# Altium schematic sheet Sheet.SchDoc
size A3; SheetNumber: 1; SheetTotal: 1
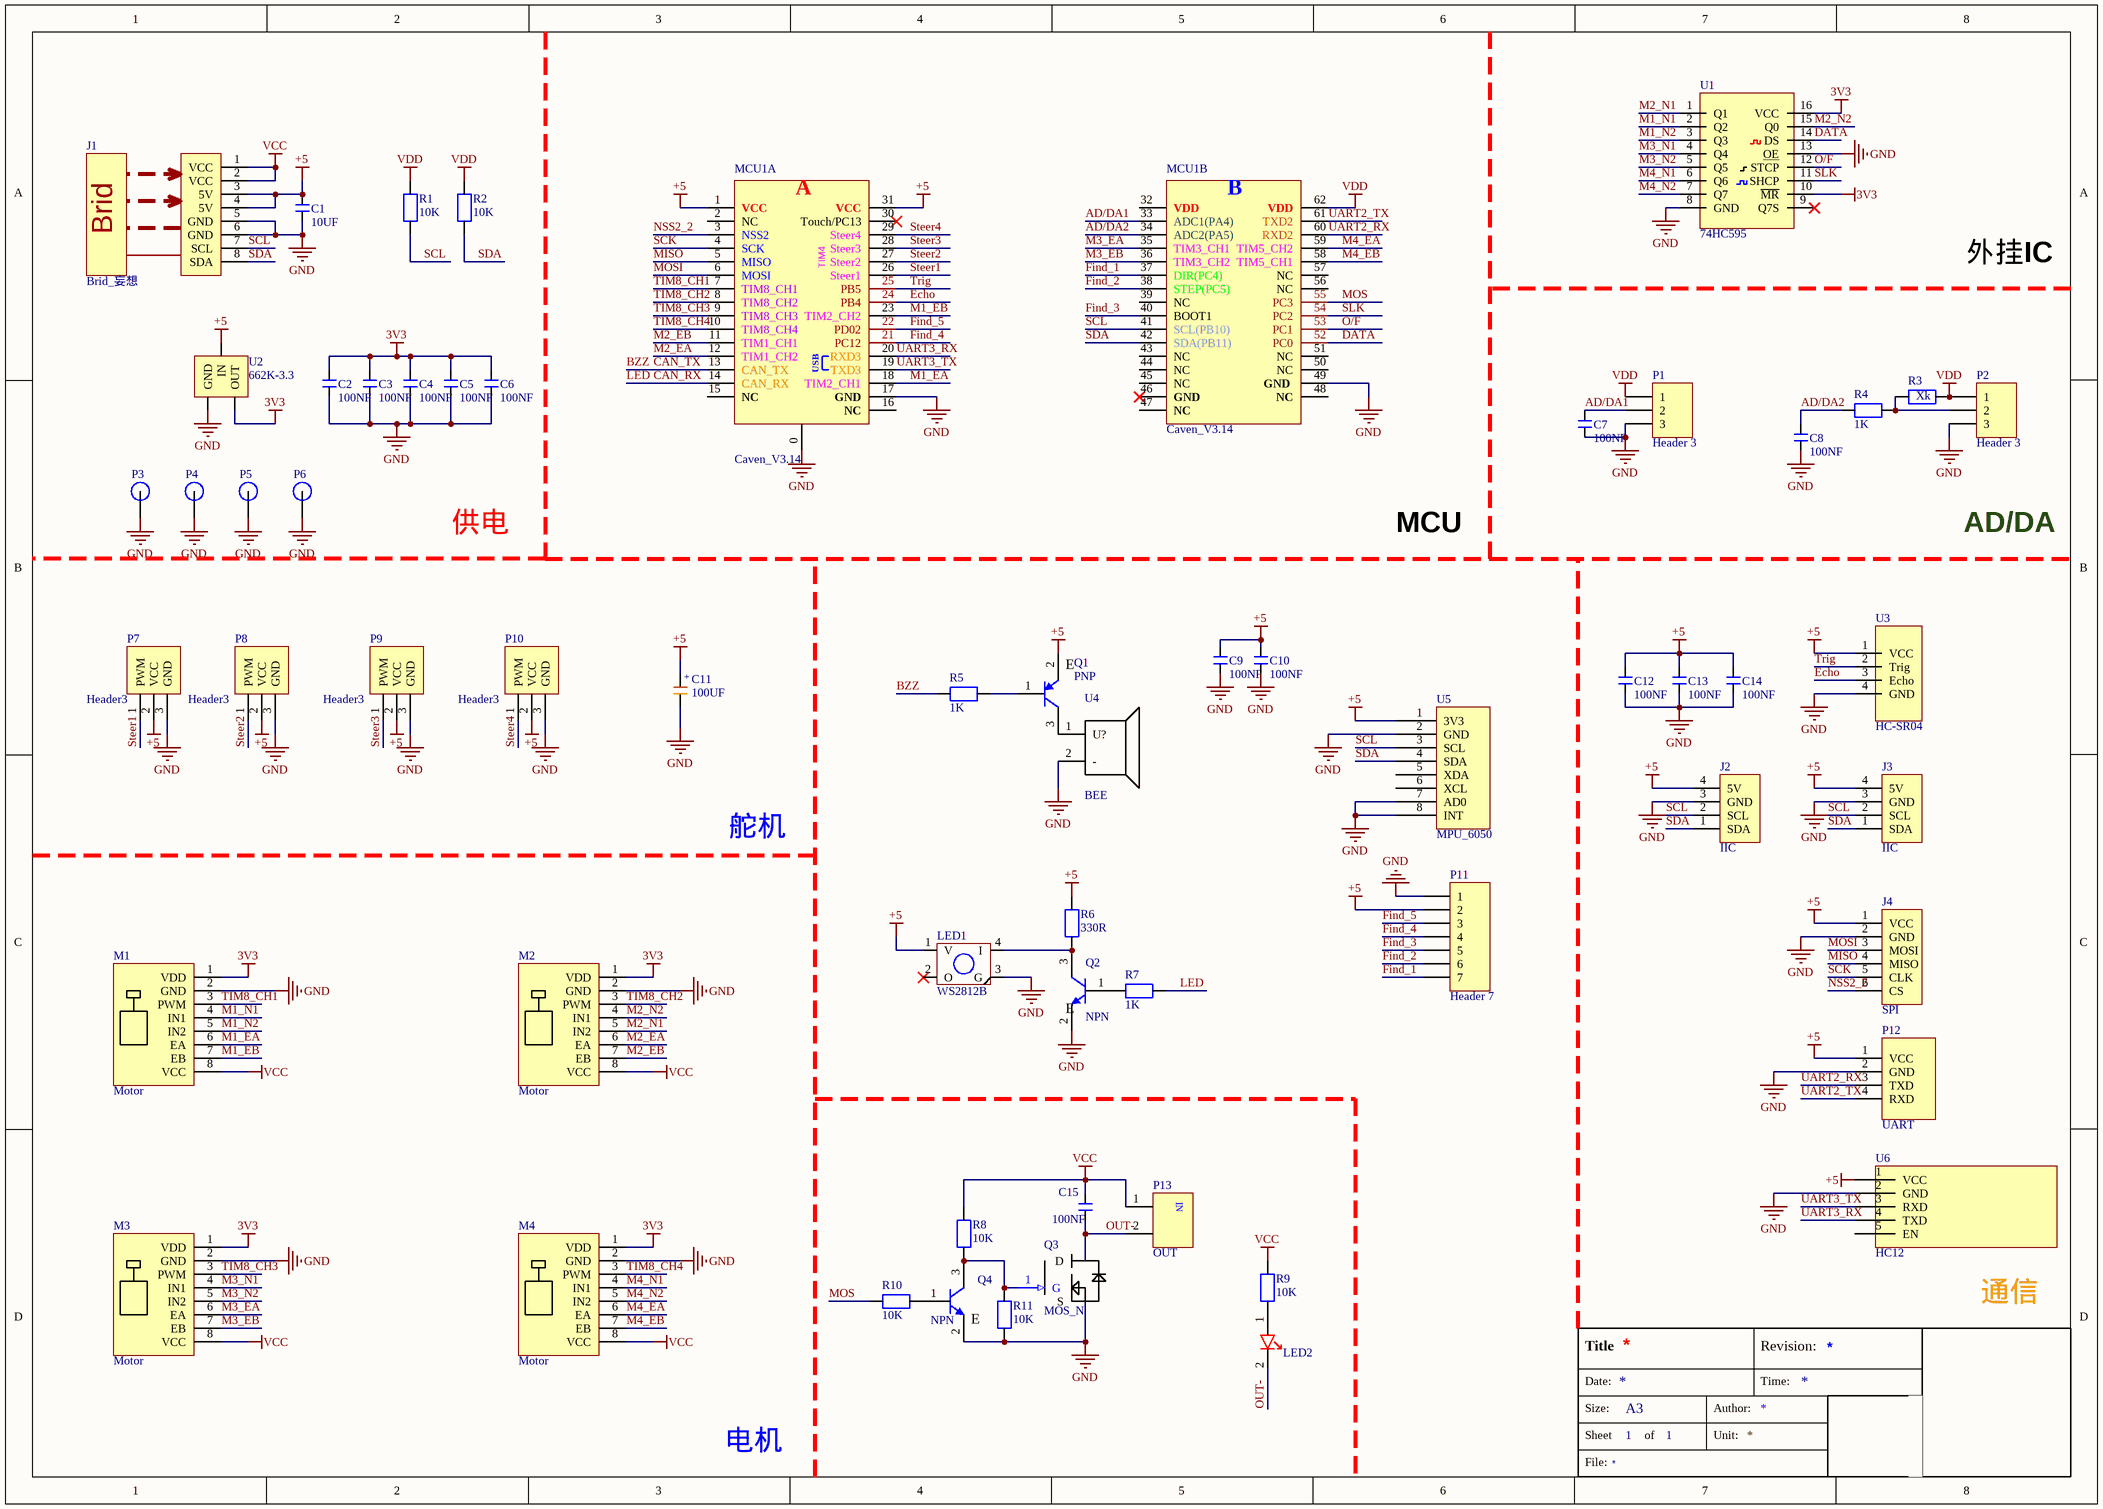
[diagram p0: Sheet.SchDoc]

## Parts
C1  10UF  [CAP_1206]
C2  100NF  [CAP_0603]
C3  100NF  [CAP_0603]
C4  100NF  [CAP_0603]
C5  100NF  [CAP_0603]
C6  100NF  [CAP_0603]
C7  100NF  [CAP_0603]
C8  100NF  [CAP_0603]
C9  100NF  [CAP_0603]
C10  100NF  [CAP_0603]
C11  100UF  [CAP_3528_B]
C12  100NF  [CAP_0603]
C13  100NF  [CAP_0603]
C14  100NF  [CAP_0603]
C15  100NF  [CAP_0603]
J1  Brid_妄想  [Brid]
J2  IIC  [XH_2.54_4P]
J3  IIC  [IIC-XH2.54-4PIN]
J4  SPI  [Header 2.54X6]
LED1  WS2812B  [5050-RGB]
LED2  LED_R/G/B/Y  [LED_5MM]  (value not drawn)
M1  Motor  [PH_2.0_8P]
M2  Motor  [PH_2.0_8P]
M3  Motor  [PH_2.0_8P]
M4  Motor  [PH_2.0_8P]
MCU1  Caven_V3.14  [Caven_3.14]  (parts A,B of 2)
P1  Header 3  [Header 2.54X3]
P2  Header 3  [Header 2.54X3]
P3  铜柱6m  [M3x6_L-Type]  (value not drawn)
P4  铜柱6m  [M3x6_L-Type]  (value not drawn)
P5  铜柱6m  [M3x6_L-Type]  (value not drawn)
P6  铜柱6m  [M3x6_L-Type]  (value not drawn)
P7  Header3  [PWM_Steer-F]
P8  Header3  [PWM_Steer-B]
P9  Header3  [PWM_Steer-F]
P10  Header3  [PWM_Steer-B]
P11  Header 7  [XH2.54-WI-7P]
P12  UART  [UART]
P13  OUT  [PIN-2_5.08]
Q1  PNP  [SOT23_3]
Q2  NPN  [SOT23_3]
Q3  MOS_N  [TO252_2]
Q4  NPN  [SOT23_3]
R1  10K  [RESC_0603_2]
R2  10K  [RESC_0603_2]
R3  Xk  [RESC_0603_2]
R4  1K  [RESC_0603_2]
R5  1K  [RESC_0603_2]
R6  330R  [RESC_0603_2]
R7  1K  [RESC_0603_2]
R8  10K  [RESC_0603_2]
R9  10K  [RESC_0603_2]
R10  10K  [RESC_0603_2]
R11  10K  [RESC_0603_2]
U1  74HC595  [SOIC_16]
U2  662K-3.3  [SOT23_3]
U3  HC-SR04  [Ultrasonic]
U4  BEE  [BEE-FMQ5mm]
U5  MPU_6050  [MPU-G521]
U6  HC12  [Header F 2.54X4]

## Nets
3V3: C2.1 C3.1 C4.1 C5.1 C6.1 M1.1(VDD) M2.1(VDD) M3.1(VDD) M4.1(VDD) U1.10(~{M}~{R}) U1.16(VCC) U2.2(OUT)
+5: C1.1 C9.2 C10.2 C11.1 C12.2 C13.2 C14.2 J1.3(5V) J1.4(5V) J2.4(5V) J3.4(5V) J4.1(VCC) LED1.1(V) MCU1.1(VCC) MCU1.31(VCC) P7.2(VCC) P8.2(VCC) P9.2(VCC) P10.2(VCC) P11.2 P12.1(VCC) Q1.2(E) R6.1 U2.3(IN) U3.1(VCC) U5.1(3V3) U6.1(VCC)
GND: C1.2 C2.2 C3.2 C4.2 C5.2 C6.2 C7.1 C8.1 C9.1 C10.1 C11.2 C12.1 C13.1 C14.1 J1.5(GND) J1.6(GND) J2.3(GND) J3.3(GND) J4.2(GND) LED1.3(G) M1.2(GND) M2.2(GND) M3.2(GND) M4.2(GND) MCU1.0 MCU1.17(GND) MCU1.49(GND) P1.3 P2.3 P3.1(IO) P4.1(IO) P5.1(IO) P6.1(IO) P7.3(GND) P8.3(GND) P9.3(GND) P10.3(GND) P11.1 P12.2(GND) Q2.2(E) Q3.2(S) Q4.2(E) R11.2 U1.8(GND) U1.13(OE) U2.1(GND) U3.4(GND) U4.2(-) U5.2(GND) U5.7(AD0) U5.8(INT) U6.2(GND)
VCC: C15.2 J1.1(VCC) J1.2(VCC) M1.8(VCC) M2.8(VCC) M3.8(VCC) M4.8(VCC) P13.1 R8.1 R9.1
VDD: MCU1.62(VDD) P1.1 P2.1 R1.1 R2.1 R3.2
AD/DA1: C7.2 MCU1.33(ADC1(PA4)) P1.2
AD/DA2: C8.2 MCU1.34(ADC2(PA5)) R4.2
BZZ: MCU1.13(CAN_TX) R5.2  [also labelled CAN_TX]
CAN_RX: MCU1.14(CAN_RX) R7.1  [also labelled LED]
DATA: MCU1.52(PC0) U1.14(DS)
Echo: MCU1.24(PB4) U3.3(Echo)
Find_1: MCU1.37(DIR(PC4)) P11.7
Find_2: MCU1.38(STEP(PC5)) P11.6
Find_3: MCU1.40(BOOT1) P11.5
Find_4: MCU1.21(PC12) P11.4
Find_5: MCU1.22(PD02) P11.3
M1_EA: M1.6(EA) MCU1.18(TIM2_CH1)
M1_EB: M1.7(EB) MCU1.23(TIM2_CH2)
M1_N1: M1.4(IN1) U1.2(Q2)
M1_N2: M1.5(IN2) U1.3(Q3)
M2_EA: M2.6(EA) MCU1.12(TIM1_CH2)
M2_EB: M2.7(EB) MCU1.11(TIM1_CH1)
M2_N1: M2.5(IN2) U1.1(Q1)
M2_N2: M2.4(IN1) U1.15(Q0)
M3_EA: M3.6(EA) MCU1.35(TIM3_CH1)
M3_EB: M3.7(EB) MCU1.36(TIM3_CH2)
M3_N1: M3.4(IN1) U1.4(Q4)
M3_N2: M3.5(IN2) U1.5(Q5)
M4_EA: M4.6(EA) MCU1.59(TIM5_CH2)
M4_EB: M4.7(EB) MCU1.58(TIM5_CH1)
M4_N1: M4.4(IN1) U1.6(Q6)
M4_N2: M4.5(IN2) U1.7(Q7)
MISO: J4.4(MISO) MCU1.5(MISO)
MOS: MCU1.55(PC3) R10.1
MOSI: J4.3(MOSI) MCU1.6(MOSI)
NSS2_2: J4.6(CS) MCU1.3(NSS2)
O/F: MCU1.53(PC1) U1.12(STCP)
OUT-: C15.1 LED2.2(-) P13.2 Q3.3(D)
SCK: J4.5(CLK) MCU1.4(SCK)
SCL: J1.7(SCL) J2.2(SCL) J3.2(SCL) MCU1.41(SCL(PB10)) R1.2 U5.3(SCL)
SDA: J1.8(SDA) J2.1(SDA) J3.1(SDA) MCU1.42(SDA(PB11)) R2.2 U5.4(SDA)
SLK: MCU1.54(PC2) U1.11(SHCP)
Steer1: MCU1.26(Steer1) P7.1(PWM)
Steer2: MCU1.27(Steer2) P8.1(PWM)
Steer3: MCU1.28(Steer3) P9.1(PWM)
Steer4: MCU1.29(Steer4) P10.1(PWM)
TIM8_CH1: M1.3(PWM) MCU1.7(TIM8_CH1)
TIM8_CH2: M2.3(PWM) MCU1.8(TIM8_CH2)
TIM8_CH3: M3.3(PWM) MCU1.9(TIM8_CH3)
TIM8_CH4: M4.3(PWM) MCU1.10(TIM8_CH4)
Trig: MCU1.25(PB5) U3.2(Trig)
UART2_RX: MCU1.60(RXD2) P12.3(TXD)
UART2_TX: MCU1.61(TXD2) P12.4(RXD)
UART3_RX: MCU1.20(RXD3) U6.4(TXD)
UART3_TX: MCU1.19(TXD3) U6.3(RXD)
NetLED1_4: LED1.4(I) Q2.3(C) R6.2
NetLED2_1: LED2.1(+) R9.2
NetP2_2: P2.2 R3.1 R4.1
NetQ1_1: Q1.1(B) R5.1
NetQ1_3: Q1.3(C) U4.1(U?)
NetQ2_1: Q2.1(B) R7.2
NetQ3_1: Q3.1(G) Q4.3(C) R8.2 R11.1
NetQ4_1: Q4.1(B) R10.2

Not connected (* = marked no-connect by the designer): LED1 2(O)*; MCU1 2(NC) 15(NC) 16(NC) 30(Touch/PC13)* 32(VDD) 39(NC) 43(NC) 44(NC) 45(NC) 46(GND)* 47(NC) 48(NC) 50(NC) 51(NC) 56(NC) 57(NC); U1 9(Q7S)*; U5 5(XDA) 6(XCL); U6 5(EN)

## Notes on the sheet
- 外挂IC
- 供电
- MCU
- AD/DA
- 舵机
- 通信
- 电机
- Title
- Date:
- Revision:
- Time:
- Size:
- Sheet
- A3
- of
- Author:
- Unit:
- File:
- (in symbol CAP_TA) +
- (in symbol Caven_V3.14, part A) A; TIM4; USB
- (in symbol Caven_V3.14, part B) B
- (in symbol IN _2PIN) IN

## Library data of the parts
C1-C10 C12-C15 = CAP: CAP  12~50V
C11 = CAP_TA: CAP  6~12V  钽电容
J1 = Brid
J2 J3 = IIC: Heard
J4 = SPI: Heard
LED1 = WS2812B: LED
LED2 = LED
M1-M4 = Motor-Brushed-port: Motor-Brushed-port,XH-1.25mm
MCU1 = Caven_V3.14: MCU_STM32F103RE
P1 P2 = Header 3: Header, 3-Pin; LatestRevisionDate: 17-Jul-2002; LatestRevisionNote: Re-released for DXP Platform.; Publisher: Altium Limited
P3-P6 = Pillar: IN-OUT
P7-P10 = PWM_D: Header
P11 = Header 7: Header, 7-Pin; LatestRevisionDate: 17-Jul-2002; LatestRevisionNote: Re-released for DXP Platform.; Publisher: Altium Limited
P12 = UART: Header
P13 = IN _2PIN: Header
Q3 = MOSFET_N: MOS
R1-R11 = RES: RES 贴片
U1 = 74HC595: IC
U2 = 662K: DC-DC
U3 = Ultrasonic: Mode
U4 = BZZ
U5 = MPU_6050: MODE
U6 = HC-12: MODE